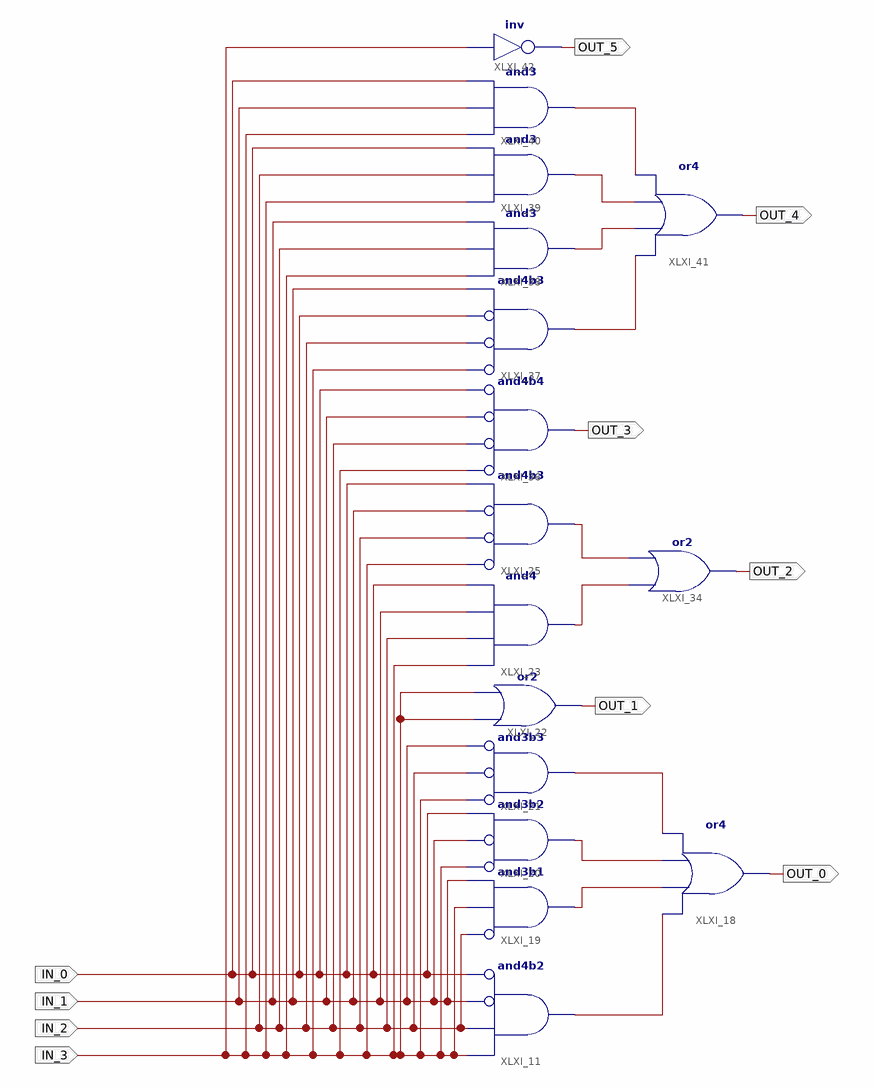
[diagram p0: schematic sheet 1]
// Xilinx ISE schematic Schematic.sch (spartan3a) as structural Verilog: 16 symbols, 10 ports
module Schematic (
  input  IN_0,
  input  IN_2,
  input  IN_1,
  input  IN_3,
  output OUT_0,
  output OUT_1,
  output OUT_2,
  output OUT_3,
  output OUT_4,
  output OUT_5
);

  wire XLXN_68, XLXN_69, XLXN_71, XLXN_72, XLXN_126, XLXN_127, XLXN_153, XLXN_154, XLXN_155, XLXN_156;

  and XLXI_11 (XLXN_72, ~IN_0, ~IN_1, IN_2, IN_3);  // and4b2
  and XLXI_19 (XLXN_71, ~IN_2, IN_3, IN_1);  // and3b1
  and XLXI_20 (XLXN_69, ~IN_3, ~IN_1, IN_0);  // and3b2
  and XLXI_21 (XLXN_68, ~IN_3, ~IN_2, ~IN_1);  // and3b3
  or XLXI_18 (OUT_0, XLXN_72, XLXN_71, XLXN_69, XLXN_68);
  or XLXI_22 (OUT_1, IN_3, IN_3);
  and XLXI_23 (XLXN_126, IN_3, IN_2, IN_1, IN_0);
  and XLXI_25 (XLXN_127, ~IN_3, ~IN_2, ~IN_1, IN_0);  // and4b3
  or XLXI_34 (OUT_2, XLXN_126, XLXN_127);
  and XLXI_36 (OUT_3, ~IN_3, ~IN_2, ~IN_1, ~IN_0);  // and4b4
  and XLXI_37 (XLXN_153, ~IN_3, ~IN_2, ~IN_0, IN_1);  // and4b3
  and XLXI_38 (XLXN_154, IN_3, IN_2, IN_1);
  and XLXI_39 (XLXN_155, IN_3, IN_2, IN_0);
  and XLXI_40 (XLXN_156, IN_3, IN_1, IN_0);
  or XLXI_41 (OUT_4, XLXN_153, XLXN_154, XLXN_155, XLXN_156);
  not XLXI_42 (OUT_5, IN_3);
endmodule
